# Altium project Mini-Ph0xx_01.PrjPcb
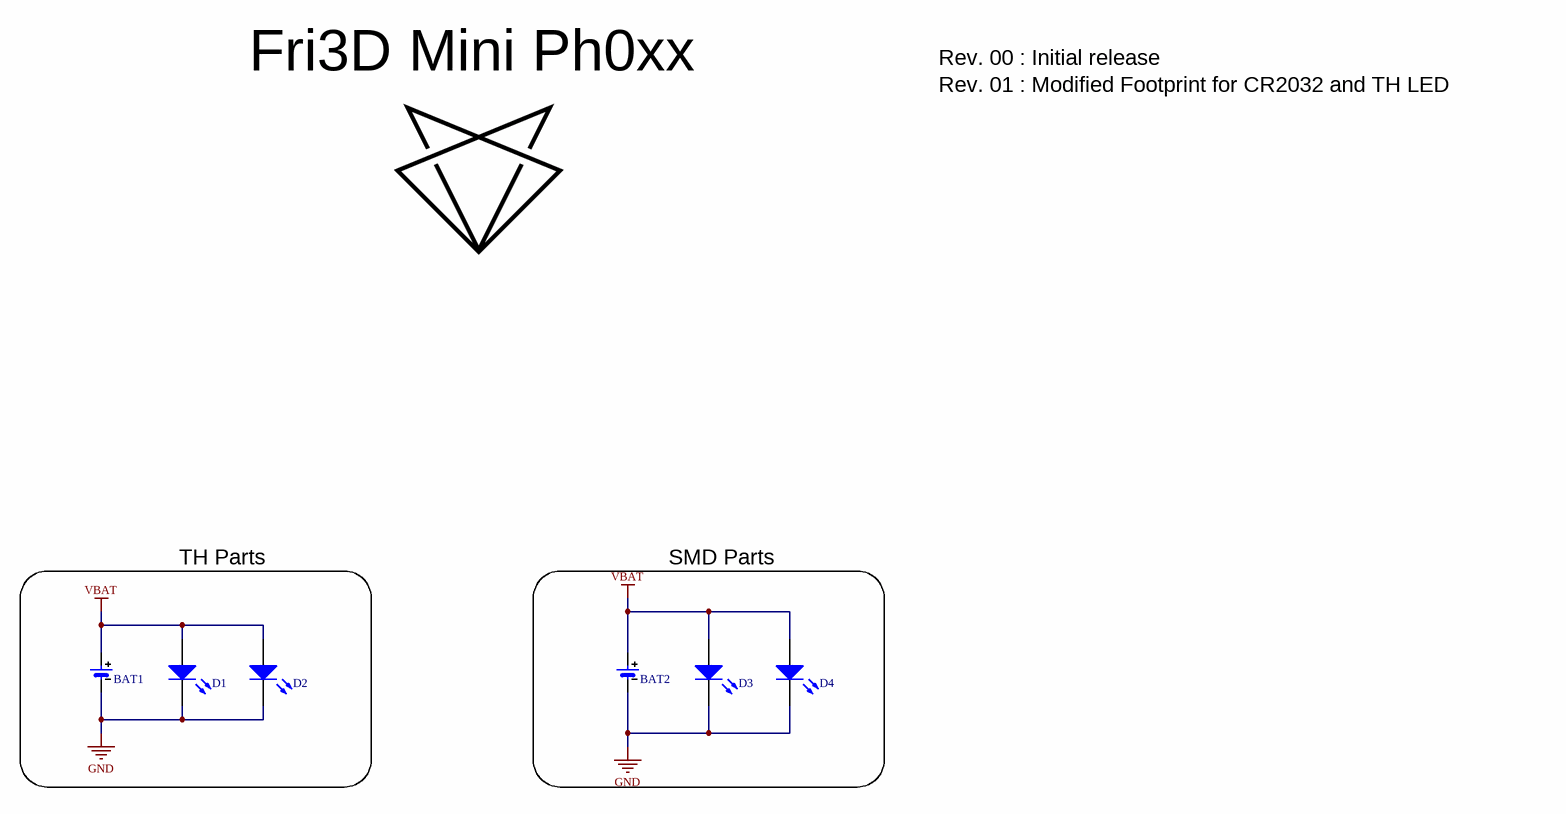
[diagram p0: Mini-Ph0xx_01.SchDoc]
PCB_ENGINEER: WimVG; PCB_REV: 01; PCB_TITLE: Mini Ph0xx
1 sheet, 6 parts. Net scope: global (net labels, ports and power ports of the same name join across sheets).
Board file: Mini-Ph0xx_01.PcbDoc

## Sheet Mini-Ph0xx_01.SchDoc: Fri3D SolderBadge 2019
size A3; Date: 02/07/2019; DrawnBy: Wim Van Gool; DocumentNumber: 1; Revision: 01; SheetNumber: 1; SheetTotal: 1

### Parts
BAT1  CR2032 Battery Holder  [BAT_CR2032_China]  (value not drawn)
BAT2  CR2032 SMD Battery Holder  [BAT_CR2032_KEY_1060]  (value not drawn)
D1  Default 5mm Blue LED  [LED_5MM_BL]  (value not drawn)
D2  Default 5mm Blue LED  [LED_5MM_BL]  (value not drawn)
D3  Default 0805 Blue LED  [LED_0805_BL]  (value not drawn)
D4  Default 0805 Blue LED  [LED_0805_BL]  (value not drawn)

### Blocks framed on the sheet
TH Parts: BAT1 D1 D2
SMD Parts: BAT2 D3 D4

### Nets
GND: BAT1.2 BAT2.2 D1.2(K) D2.2(K) D3.2(K) D4.2(K)
VBAT: BAT1.1 BAT2.1 D1.1(A) D2.1(A) D3.1(A) D4.1(A)

### Notes on the sheet
- Fri3D Mini Ph0xx
- Rev. 00 : Initial release
- Rev. 01 : Modified Footprint for CR2032 and TH LED
- Title
- Revision
- Date
- Dranw By
- Size
- A3
- Sheet
- of

### Library data of the parts
BAT1 = BAT 20mm Coin Cell Holder Generic: =Description; Value: CR2032; Supplier 1: China
BAT2 = BAT # 20mm Coin Cell Holder Keystone 1060: =Description; Value: CR2032; Supplier 1: Digi-key; Supplier Part Number 1: 36-1060-ND; Supplier 2: Aliexpress
D1 D2 = LED Blue 5mm: =Description
D3 D4 = LED # Blue 0805: =Description; Description: LED # Blue 0805; Supplier 1: Farnell; Supplier Part Number 1: 2217980

## Assembly variants
TH_KIT: not fitted BAT2 D3 D4
SMD_KIT: not fitted BAT1 D1 D2